# Altium schematic sheet Sheet1.SchDoc: VISB
size 420 x 297 mm; ApprovedBy: PBaizan; CheckedBy: PBaizan; Author: PBaizan; CompanyName: IONOSENS; DrawnBy: PBaizan; Engineer: PBaizan; Organization: IONOSENS; DocumentNumber: 20210001001SCH; Revision: 01; SheetNumber: 01; SheetTotal: 03; PartNumber: 20210001001; SubTitle: VISIR Instrument Supply Board (Control); Scale: None; ConfigElement: VISB; CAGE_CODE: 0001-21; DOC_NO_SCH_DWG: 210001001SCH; PROJECT: VISIR; ENG_APP_DATE: 16/09/2021; DSN_APP_DATE: 16/09/2021; CHK_APP_DATE: 16/09/2021
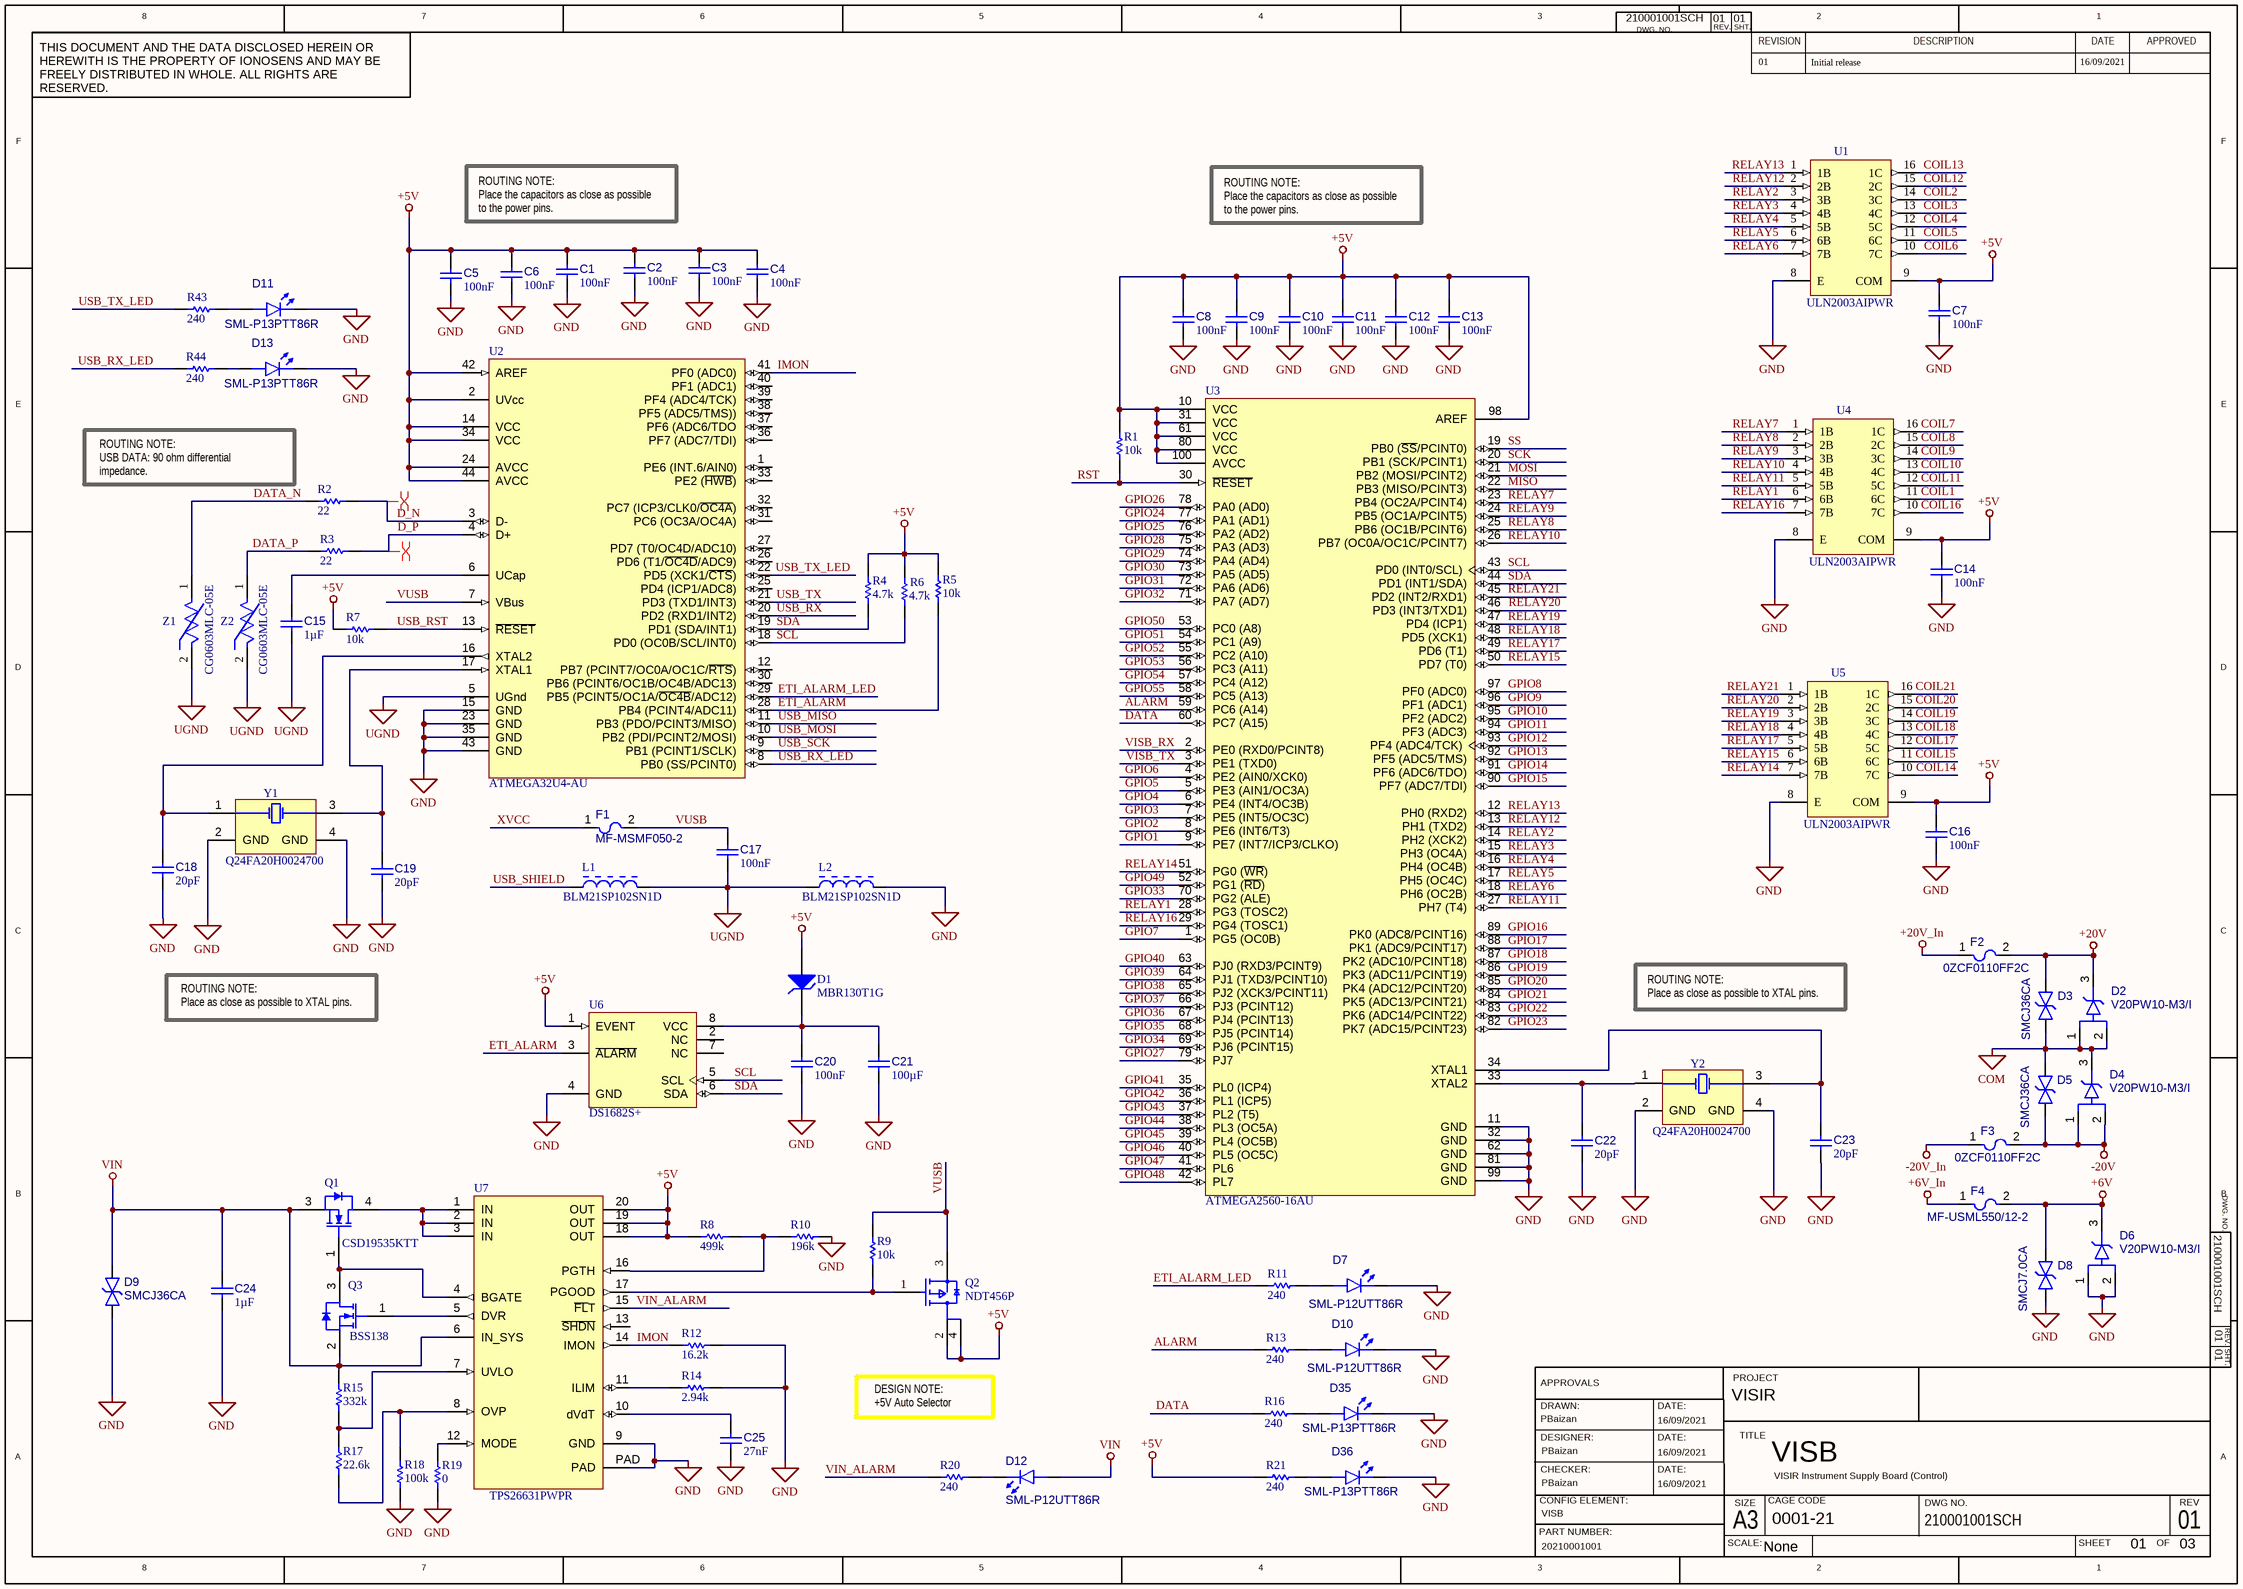
[diagram p0: Sheet1.SchDoc]

## Parts
C1  value 100nF  [CAPC1005X06M]  (hidden comment: CC0402JRX7R7BB104)
C2  value 100nF  [CAPC1005X06M]  (hidden comment: CC0402JRX7R7BB104)
C3  value 100nF  [CAPC1005X06M]  (hidden comment: CC0402JRX7R7BB104)
C4  value 100nF  [CAPC1005X06M]  (hidden comment: CC0402JRX7R7BB104)
C5  value 100nF  [CAPC1005X06M]  (hidden comment: CC0402JRX7R7BB104)
C6  value 100nF  [CAPC1005X06M]  (hidden comment: CC0402JRX7R7BB104)
C7  value 100nF  [CAPC1005X06M]  (hidden comment: CC0402JRX7R7BB104)
C8  value 100nF  [CAPC1005X06M]  (hidden comment: CC0402JRX7R7BB104)
C9  value 100nF  [CAPC1005X06M]  (hidden comment: CC0402JRX7R7BB104)
C10  value 100nF  [CAPC1005X06M]  (hidden comment: CC0402JRX7R7BB104)
C11  value 100nF  [CAPC1005X06M]  (hidden comment: CC0402JRX7R7BB104)
C12  value 100nF  [CAPC1005X06M]  (hidden comment: CC0402JRX7R7BB104)
C13  value 100nF  [CAPC1005X06M]  (hidden comment: CC0402JRX7R7BB104)
C14  value 100nF  [CAPC1005X06M]  (hidden comment: CC0402JRX7R7BB104)
C15  value 1µF  [CAPC1608X09M]  (hidden comment: CC0603JRX7R7BB105)
C16  value 100nF  [CAPC1005X06M]  (hidden comment: CC0402JRX7R7BB104)
C17  value 100nF  [CAPC1005X06M]  (hidden comment: CC0402JRX7R7BB104)
C18  value 20pF  [CAPC1005X06M]  (hidden comment: CC0402JRNPO9BN200)
C19  value 20pF  [CAPC1005X06M]  (hidden comment: CC0402JRNPO9BN200)
C20  value 100nF  [CAPC1005X06M]  (hidden comment: CC0402JRX7R7BB104)
C21  value 100µF  [CAPC3225X27M]  (hidden comment: EMK325ABJ107MM-P)
C22  value 20pF  [CAPC1005X06M]  (hidden comment: CC0402JRNPO9BN200)
C23  value 20pF  [CAPC1005X06M]  (hidden comment: CC0402JRNPO9BN200)
C24  value 1µF  [CAPC3225X22M]  (hidden comment: CC1210KKX7R0BB105)
C25  value 27nF  [CAPC2012X14M]  (hidden comment: CC0805JRX7R9BB273)
D1  MBR130T1G  [TSSOP0P360X135-2M]
D2  V20PW10-M3/I  [DPAK229P900X140-3M]
D3  SMCJ36CA  [DIOM6959X26M]
D4  V20PW10-M3/I  [DPAK229P900X140-3M]
D5  SMCJ36CA  [DIOM6959X26M]
D6  V20PW10-M3/I  [DPAK229P900X140-3M]
D7  SML-P12UTT86R  [DIOC1005X02R]
D8  SMCJ7.0CA  [DIOM6959X26M]
D9  SMCJ36CA  [DIOM6959X26M]
D10  SML-P12UTT86R  [DIOC1005X02R]
D11  SML-P13PTT86R  [DIOC1005X02R]
D12  SML-P12UTT86R  [DIOC1005X02R]
D13  SML-P13PTT86R  [DIOC1005X02R]
D35  SML-P13PTT86R  [DIOC1005X02R]
D36  SML-P13PTT86R  [DIOC1005X02R]
F1  MF-MSMF050-2  [BOUR-MF-MSMF050-2_V]
F2  0ZCF0110FF2C  [RESC7451X09M]
F3  0ZCF0110FF2C  [RESC7451X09M]
F4  MF-USML550/12-2  [RESC3226X12M]
L1  BLM21SP102SN1D  [INDC2012X10M]
L2  BLM21SP102SN1D  [INDC2012X10M]
Q1  CSD19535KTT  [DPAK254P1510X470-3M]
Q2  NDT456P  [SOT230P700X180-4M]
Q3  BSS138  [SOT95P237X111-3M]
R1  value 10k  [RESC1005X04M]  (hidden comment: AC0402FR-0710KL)
R2  value 22  [RESC1005X04M]  (hidden comment: AC0402FR-0722RL)
R3  value 22  [RESC1005X04M]  (hidden comment: AC0402FR-0722RL)
R4  value 4.7k  [RESC1005X04M]  (hidden comment: AC0402FR-074K7L)
R5  value 10k  [RESC1005X04M]  (hidden comment: AC0402FR-0710KL)
R6  value 4.7k  [RESC1005X04M]  (hidden comment: AC0402FR-074K7L)
R7  value 10k  [RESC1005X04M]  (hidden comment: AC0402FR-0710KL)
R8  value 499k  [RESC1005X04M]  (hidden comment: AC0402FR-07499KL)
R9  value 10k  [RESC1005X04M]  (hidden comment: AC0402FR-0710KL)
R10  value 196k  [RESC1005X04M]  (hidden comment: AC0402FR-07196KL)
R11  value 240  [RESC1005X04M]  (hidden comment: AC0402FR-07240RL)
R12  value 16.2k  [RESC1005X04M]  (hidden comment: AC0402FR-0716K2L)
R13  value 240  [RESC1005X04M]  (hidden comment: AC0402FR-07240RL)
R14  value 2.94k  [RESC1005X04M]  (hidden comment: AC0402FR-072K94L)
R15  value 332k  [RESC1005X04M]  (hidden comment: AC0402FR-07332KL)
R16  value 240  [RESC1005X04M]  (hidden comment: AC0402FR-07240RL)
R17  value 22.6k  [RESC1005X04M]  (hidden comment: AC0402FR-0722K6L)
R18  value 100k  [RESC1005X04M]  (hidden comment: AC0402FR-07100KL)
R19  value 0  [RESC1608X06M]  (hidden comment: AC0603FR-070RL)
R20  value 240  [RESC1005X04M]  (hidden comment: AC0402FR-07240RL)
R21  value 240  [RESC1005X04M]  (hidden comment: AC0402FR-07240RL)
R43  value 240  [RESC1005X04M]  (hidden comment: AC0402FR-07240RL)
R44  value 240  [RESC1005X04M]  (hidden comment: AC0402FR-07240RL)
U1  ULN2003AIPWR  [TSOP65P640X120-16M]
U2  ATMEGA32U4-AU  [TQFP80P1200X1200X120-44M]
U3  ATMEGA2560-16AU  [ATML-100A_M]
U4  ULN2003AIPWR  [TSOP65P640X120-16M]
U5  ULN2003AIPWR  [TSOP65P640X120-16M]
U6  DS1682S+  [SOIC127P600X175-8M]
U7  TPS26631PWPR  [TSOP65P640X120_HS-21M]
Y1  Q24FA20H0024700  [FA-20H]
Y2  Q24FA20H0024700  [FA-20H]
Z1  CG0603MLC-05E  [RESC1608X06M]
Z2  CG0603MLC-05E  [RESC1608X06M]

## Nets
+5V: C1.2 C2.2 C3.2 C4.2 C5.2 C6.2 C7.2 C8.2 C9.2 C10.2 C11.2 C12.2 C13.2 C14.2 C16.2 D1.1(A) Q2.2(D) Q2.4(D) R1.2 R4.2 R5.2 R6.2 R7.2 R8.2 R21.1 U1.9(COM) U2.2(UVcc) U2.14(VCC) U2.24(AVCC) U2.34(VCC) U2.42(AREF) U2.44(AVCC) U3.10(VCC) U3.31(VCC) U3.61(VCC) U3.80(VCC) U3.98(AREF) U3.100(AVCC) U4.9(COM) U5.9(COM) U6.1(EVENT) U7.18(OUT) U7.19(OUT) U7.20(OUT)
+6V: D6.3(K) D8.2(A) F4.2
+6V_In: F4.1
+20V: D2.3(K) D3.1(A) F2.2
+20V_In: F2.1
-20V: D4.1(A) D4.2(A) D5.2(A) F3.2
-20V_In: F3.1
COM: D2.1(A) D2.2(A) D3.2(A) D4.3(K) D5.1(A)
GND: C1.1 C2.1 C3.1 C4.1 C5.1 C6.1 C7.1 C8.1 C9.1 C10.1 C11.1 C12.1 C13.1 C14.1 C16.1 C18.1 C19.1 C20.1 C21.1 C22.1 C23.1 C24.1 C25.1 D6.1(A) D6.2(A) D7.1(K) D8.1(A) D9.2(A) D10.1(K) D11.1(K) D13.1(K) D35.1(K) D36.1(K) L2.2 R10.1 R12.2 R14.2 R18.1 R19.1 U1.8(E) U2.15(GND) U2.23(GND) U2.35(GND) U2.43(GND) U3.11(GND) U3.32(GND) U3.62(GND) U3.81(GND) U3.99(GND) U4.8(E) U5.8(E) U6.4(GND) U7.9(GND) U7.PAD Y1.2(GND) Y1.4(GND) Y2.2(GND) Y2.4(GND)
UGND: C15.1 C17.1 L1.2 L2.1 U2.5(UGnd) Z1.2 Z2.2
VIN: C24.2 D9.1(A) D12.2(A) Q1.3(S) Q3.2(S) R15.2 U7.6(IN_SYS)
ALARM: R13.1 U3.59(PC6_(A14))
COIL1: U4.11(6C)
COIL2: U1.14(3C)
COIL3: U1.13(4C)
COIL4: U1.12(5C)
COIL5: U1.11(6C)
COIL6: U1.10(7C)
COIL7: U4.16(1C)
COIL8: U4.15(2C)
COIL9: U4.14(3C)
COIL10: U4.13(4C)
COIL11: U4.12(5C)
COIL12: U1.15(2C)
COIL13: U1.16(1C)
COIL14: U5.10(7C)
COIL15: U5.11(6C)
COIL16: U4.10(7C)
COIL17: U5.12(5C)
COIL18: U5.13(4C)
COIL19: U5.14(3C)
COIL20: U5.15(2C)
COIL21: U5.16(1C)
D_N: R2.2 U2.3(D-)
D_P: R3.2 U2.4(D+)
DATA: R16.1 U3.60(PC7_(A15))
DATA_N: R2.1 Z1.1
DATA_P: R3.1 Z2.1
ETI_ALARM: R5.1 U2.28(PB4_(PCINT4/ADC11)) U6.3(~{ALARM})
ETI_ALARM_LED: R11.1 U2.29(PB5_(PCINT5/OC1A/~{OC4B}/ADC12))
GPIO1: U3.9(PE7_(INT7/ICP3/CLKO))
GPIO2: U3.8(PE6_(INT6/T3))
GPIO3: U3.7(PE5_(INT5/OC3C))
GPIO4: U3.6(PE4_(INT4/OC3B))
GPIO5: U3.5(PE3_(AIN1/OC3A))
GPIO6: U3.4(PE2_(AIN0/XCK0))
GPIO7: U3.1(PG5_(OC0B))
GPIO8: U3.97(PF0_(ADC0))
GPIO9: U3.96(PF1_(ADC1))
GPIO10: U3.95(PF2_(ADC2))
GPIO11: U3.94(PF3_(ADC3))
GPIO12: U3.93(PF4_(ADC4/TCK))
GPIO13: U3.92(PF5_(ADC5/TMS))
GPIO14: U3.91(PF6_(ADC6/TDO))
GPIO15: U3.90(PF7_(ADC7/TDI))
GPIO16: U3.89(PK0_(ADC8/PCINT16))
GPIO17: U3.88(PK1_(ADC9/PCINT17))
GPIO18: U3.87(PK2_(ADC10/PCINT18))
GPIO19: U3.86(PK3_(ADC11/PCINT19))
GPIO20: U3.85(PK4_(ADC12/PCINT20))
GPIO21: U3.84(PK5_(ADC13/PCINT21))
GPIO22: U3.83(PK6_(ADC14/PCINT22))
GPIO23: U3.82(PK7_(ADC15/PCINT23))
GPIO24: U3.77(PA1_(AD1))
GPIO25: U3.76(PA2_(AD2))
GPIO26: U3.78(PA0_(AD0))
GPIO27: U3.79(PJ7)
GPIO28: U3.75(PA3_(AD3))
GPIO29: U3.74(PA4_(AD4))
GPIO30: U3.73(PA5_(AD5))
GPIO31: U3.72(PA6_(AD6))
GPIO32: U3.71(PA7_(AD7))
GPIO33: U3.70(PG2_(ALE))
GPIO34: U3.69(PJ6_(PCINT15))
GPIO35: U3.68(PJ5_(PCINT14))
GPIO36: U3.67(PJ4_(PCINT13))
GPIO37: U3.66(PJ3_(PCINT12))
GPIO38: U3.65(PJ2_(XCK3/PCINT11))
GPIO39: U3.64(PJ1_(TXD3/PCINT10))
GPIO40: U3.63(PJ0_(RXD3/PCINT9))
GPIO41: U3.35(PL0_(ICP4))
GPIO42: U3.36(PL1_(ICP5))
GPIO43: U3.37(PL2_(T5))
GPIO44: U3.38(PL3_(OC5A))
GPIO45: U3.39(PL4_(OC5B))
GPIO46: U3.40(PL5_(OC5C))
GPIO47: U3.41(PL6)
GPIO48: U3.42(PL7)
GPIO49: U3.52(PG1_(~{RD}))
GPIO50: U3.53(PC0_(A8))
GPIO51: U3.54(PC1_(A9))
GPIO52: U3.55(PC2_(A10))
GPIO53: U3.56(PC3_(A11))
GPIO54: U3.57(PC4_(A12))
GPIO55: U3.58(PC5_(A13))
IMON: R12.1 U2.41(PF0_(ADC0)) U7.14(IMON)
MISO: U3.22(PB3_(MISO/PCINT3))
MOSI: U3.21(PB2_(MOSI/PCINT2))
RELAY1: U3.28(PG3_(TOSC2)) U4.6(6B)
RELAY2: U1.3(3B) U3.14(PH2_(XCK2))
RELAY3: U1.4(4B) U3.15(PH3_(OC4A))
RELAY4: U1.5(5B) U3.16(PH4_(OC4B))
RELAY5: U1.6(6B) U3.17(PH5_(OC4C))
RELAY6: U1.7(7B) U3.18(PH6_(OC2B))
RELAY7: U3.23(PB4_(OC2A/PCINT4)) U4.1(1B)
RELAY8: U3.25(PB6_(OC1B/PCINT6)) U4.2(2B)
RELAY9: U3.24(PB5_(OC1A/PCINT5)) U4.3(3B)
RELAY10: U3.26(PB7_(OC0A/OC1C/PCINT7)) U4.4(4B)
RELAY11: U3.27(PH7_(T4)) U4.5(5B)
RELAY12: U1.2(2B) U3.13(PH1_(TXD2))
RELAY13: U1.1(1B) U3.12(PH0_(RXD2))
RELAY14: U3.51(PG0_(~{WR})) U5.7(7B)
RELAY15: U3.50(PD7_(T0)) U5.6(6B)
RELAY16: U3.29(PG4_(TOSC1)) U4.7(7B)
RELAY17: U3.49(PD6_(T1)) U5.5(5B)
RELAY18: U3.48(PD5_(XCK1)) U5.4(4B)
RELAY19: U3.47(PD4_(ICP1)) U5.3(3B)
RELAY20: U3.46(PD3_(INT3/TXD1)) U5.2(2B)
RELAY21: U3.45(PD2_(INT2/RXD1)) U5.1(1B)
RST: R1.1 U3.30(~{RESET})
SCK: U3.20(PB1_(SCK/PCINT1))
SCL: R6.1 U2.18(PD0_(OC0B/SCL/INT0)) U3.43(PD0_(INT0/SCL)) U6.5(SCL)
SDA: R4.1 U2.19(PD1_(SDA/INT1)) U3.44(PD1_(INT1/SDA)) U6.6(SDA)
SS: U3.19(PB0_(~{SS}/PCINT0))
USB_MISO: U2.11(PB3_(PDO/PCINT3/MISO))
USB_MOSI: U2.10(PB2_(PDI/PCINT2/MOSI))
USB_RST: R7.1 U2.13(~{RESET})
USB_RX: U2.20(PD2_(RXD1/INT2))
USB_RX_LED: R44.1 U2.8(PB0_(SS/PCINT0))
USB_SCK: U2.9(PB1_(PCINT1/SCLK))
USB_SHIELD: L1.1
USB_TX: U2.21(PD3_(TXD1/INT3))
USB_TX_LED: R43.1 U2.22(PD5_(XCK1/~{CTS}))
VIN_ALARM: R20.1 U7.15(~{FL}T)
VISB_RX: U3.2(PE0_(RXD0/PCINT8))
VISB_TX: U3.3(PE1_(TXD0))
VUSB: C17.2 F1.2 Q2.3(S) R9.2 U2.7(VBus)
XVCC: F1.1
NetC15_2: C15.2 U2.6(UCap)
NetC18_2: C18.2 U2.16(XTAL2) Y1.1(X1)
NetC19_2: C19.2 U2.17(XTAL1) Y1.3(X2)
NetC20_2: C20.2 C21.2 D1.2(K) U6.8(VCC)
NetC22_2: C22.2 U3.33(XTAL2) Y2.1(X1)
NetC23_2: C23.2 U3.34(XTAL1) Y2.3(X2)
NetC25_2: C25.2 U7.10(dVdT)
NetD7_2: D7.2(A) R11.2
NetD10_2: D10.2(A) R13.2
NetD11_2: D11.2(A) R43.2
NetD12_1: D12.1(K) R20.2
NetD13_2: D13.2(A) R44.2
NetD35_2: D35.2(A) R16.2
NetD36_2: D36.2(A) R21.2
NetQ1_1: Q1.1(G) Q3.3(D) U7.4(BGATE)
NetQ1_4: Q1.4(D) U7.1(IN) U7.2(IN) U7.3(IN)
NetQ2_1: Q2.1(G) R9.1 U7.17(PGOOD)
NetQ3_1: Q3.1(G) U7.5(DVR)
NetR8_1: R8.1 R10.2 U7.16(PGTH)
NetR14_1: R14.1 U7.11(ILIM)
NetR15_1: R15.1 R17.2 U7.7(UVLO)
NetR17_1: R17.1 R18.2 U7.8(OVP)
NetR19_2: R19.2 U7.12(MODE)

Not connected (* = marked no-connect by the designer): U2 1(PE6_(INT.6/AIN0)) 12(PB7_(PCINT7/OC0A/OC1C/~{RTS})) 25(PD4_(ICP1/ADC8)) 26(PD6_(T1/~{OC4D}/ADC9)) 27(PD7_(T0/OC4D/ADC10)) 30(PB6_(PCINT6/OC1B/OC4B/ADC13)) 31(PC6_(OC3A/OC4A)) 32(PC7_(ICP3/CLK0/~{OC4A})) 33(PE2_(~{HWB})) 36(PF7_(ADC7/TDI)) 37(PF6_(ADC6/TDO) 38(PF5_(ADC5/TMS))) 39(PF4_(ADC4/TCK)) 40(PF1_(ADC1)); U6 2(NC) 7(NC); U7 13(~{SHDN})

## Layout directives
differential pair: D_N, D_P

## Notes on the sheet
- 01
- Initial release
- 16/09/2021
- ROUTING NOTE:
  Place the capacitors as close as possible to the power pins.
- ROUTING NOTE:
  USB DATA: 90 ohm differential impedance.
- ROUTING NOTE:
  Place as close as possible to XTAL pins.
- DESIGN NOTE:
  +5V Auto Selector
- 8
- 7
- 6
- 5
- 4
- 3
- DWG. NO.
- REV.
- SHT.
- REVISION
- 2
- DESCRIPTION
- DATE
- 1
- APPROVED
- THIS DOCUMENT AND THE DATA DISCLOSED HEREIN OR HEREWITH IS THE PROPERTY OF IONOSENS AND MAY BE FREELY DISTRIBUTED IN WHOLE. ALL RIGHTS ARE RESERVED.
- F
- E
- D
- C
- B
- DRAWN:
- APPROVALS
- DATE:
- PROJECT
- A
- CHECKER:
- DESIGNER:
- TITLE
- PART NUMBER:
- CONFIG ELEMENT:
- SCALE:
- A3
- SIZE
- CAGE CODE
- DWG NO.
- SHEET
- OF
- REV

## Library data of the parts
C1-C14 C16 C17 C20 = C01-0402-01-00001-1: Cap Ceramic 100nF 50V X7R 5% SMD 0402 125°C; Manufacturer: YAGEO; Voltage Rating: 16V; Case/Package: 0402; Capacitor Type: Ceramic; Min Operating Temperature: -55°C; Width: 508µm; Length: 1mm; Tolerance: 5%; Dielectric: X7R; RoHS Compliant: Yes; Pins: 2; Composition: Ceramic; Depth: 500µm; Voltage Rating (DC): 16V; Mount: Surface Mount; Mounting Technology: Surface Mount; Termination: SMD/SMT; Manufacturer P/N: CC0402JRX7R7BB104; Thickness: 558.8µm; Max Operating Temperature: 125°C
C15 = C01-0402-01-00004-1: Cap Ceramic 1uF 16V XR7 5% SMD 0603 125°C; Manufacturer: YAGEO; Voltage Rating: 16V; Pins: 2; Width: 810µm; Manufacturer P/N: CC0603JRX7R7BB105; Depth: 800µm; Capacitor Type: Ceramic; Max Operating Temperature: 125°C; Mounting Technology: Surface Mount; Dielectric: XR7; Mount: Surface Mount; Voltage Rating (DC): 16V; Composition: Ceramic; Tolerance: 5%; RoHS Compliant: Yes; Min Operating Temperature: -55°C; Thickness: 800µm; Termination: SMD/SMT; Length: 1.6mm; Case/Package: 0603
C18 C19 C22 C23 = C01-0402-01-00008-1: Cap Ceramic 20pF 50V C0G 5% SMD 0402 125°C; Manufacturer: YAGEO; Dielectric: COG; Case/Package: 0402; Tolerance: 5%; Thickness: 558.8µm; Termination: SMD/SMT; Manufacturer P/N: CC0402JRNPO9BN200; Voltage Rating: 50V; Length: 990.6µm; Depth: 500µm; Width: 508µm; Min Operating Temperature: -55°C; Mount: Surface Mount; Voltage Rating (DC): 50V; Pins: 2; Capacitor Type: Ceramic; RoHS Compliant: Yes; Composition: Ceramic; Mounting Technology: Surface Mount; Max Operating Temperature: 125°C
C21 = C01-0402-01-00002-1: Multilayer Ceramic Capacitors (High dielectric type), 16V, 100 uF, ± 20 %, 1210, X5R, RoHS; Manufacturer: Taiyo Yuden; Tolerance: 20%; Dielectric: XR5; Min Operating Temperature: -55°C; Voltage Rating (DC): 16V; Pins: 2; Composition: Ceramic; Mount: SMD; Manufacturer P/N: EMK325ABJ107MM-P; Capacitor Type: Multilayer Ceramic; Thickness: 2.2m; RoHS Compliant: Yes; Termination: -; Depth: 2.2m; Case/Package: 1210; Max Operating Temperature: 85°C; Voltage Rating: 16V; Length: 3.5m; Width: 2.8m; Mounting Technology: SMD
C24 = C01-0402-01-00005-1: 1210 100 V 1 uF X7R ±10% Tolerance Multilayer Ceramic Chip Capacitor; Manufacturer: YAGEO; Voltage Rating (DC): 100V; Depth: 2.5mm; Case/Package: 1210; Width: 2.4892mm; Manufacturer P/N: CC1210KKX7R0BB105; Tolerance: 10%; Min Operating Temperature: -55°C; RoHS Compliant: Yes; Capacitor Type: Multilayer Ceramic; Composition: Ceramic; Thickness: 2.2098mm; Mount: Surface Mount; Termination: -; Length: 3.2004mm; Max Operating Temperature: 125°C; Mounting Technology: SMD; Voltage Rating: 100V; Dielectric: X7R; Pins: 2
C25 = C01-0402-01-00003-1: Cap Ceramic 27nF 50V X7R 5% SMD 0805 125°C; Manufacturer: YAGEO; Dielectric: XR7; Manufacturer P/N: CC0805JRX7R9BB273; Termination: SMD/SMT; Depth: 1.25mm; Max Operating Temperature: 125°C; Voltage Rating (DC): 50V; Length: 2mm; Capacitor Type: Ceramic; RoHS Compliant: Yes; Case/Package: 0805; Thickness: 711.2µm; Mount: Surface Mount; Width: 1.2466mm; Voltage Rating: 50V; Tolerance: 5%; Mounting Technology: Surface Mount; Min Operating Temperature: -55°C; Pins: 2; Composition: Ceramic
D1 = CMP-004-00031-2: DIODE SCHOTTKY 30V 1A SOD123 / Rectifier Diode Schottky 30V 1A 2-Pin SOD-123; Manufacturer: ON Semiconductor; Forward Voltage: 470mV; Max Surge Current: 5.5A; Forward Current: 1A; Mounting Technology: SMD; Manufacturer P/N: MBR130T1G; RoHS Compliant: yes; Pins: 2; Case/Package: SOD-123-2; Max Operating Temperature: 125°C; Min Operating Temperature: -65°C; Peak Inverse Voltage: 30V
D2 D4 D6 = CMP-004-00033-1: Schottky Rectifier, 100V, 20A, TO-252AE Rohs Compliant: Yes; Manufacturer: Vishay; Forward Voltage: 600mV; Max Surge Current: 200A; Case/Package: SlimDPAK (TO-252AE); Max Operating Temperature: 150°C; Manufacturer P/N: V20PW10-M3/I; Forward Current: 20A; Pins: 3; Peak Inverse Voltage: 100V; RoHS Compliant: Yes; Min Operating Temperature: -40°C; Mounting Technology: SMD
D3 D5 D9 = CMP-004-00032-1: Diode Tvs Vwm 36V 1.5Kw Bidir Smc Rohs Compliant; Manufacturer: Bourns; Peak Inverse Voltage: 40V; Max Surge Current: 200A; Manufacturer P/N: SMCJ36CA; Max Operating Temperature: 150°C; Pins: 2; Min Operating Temperature: -55°C; RoHS Compliant: Yes; Mounting Technology: SMD; Case/Package: SMD; Forward Voltage: 40V; Forward Current: 200A
D7 D10 D12 = D01-0402-01-00001-1: Led red 0402; Manufacturer: ROHM; Number of LEDs: 1; Max Power Dissipation: 52mW; Luminous Intensity: 85 mcd; Dominant Wavelength: 620 nm; Lens Style: Rectangular, Square; Forward Current: 20 mA; Forward Voltage: 2V; Mounting Technology: SMD; Case/Package: 0402; Min Operating Temperature: -40°C; Max Operating Temperature: 85°C; Manufacturer P/N: SML-P12UTT86R; Colour: red; RoHS Compliant: Yes; Pins: 2
D8 = CMP-004-00035-1: Diode Tvs Vwm 7V 1.5Kw Bidir Smc Rohs Compliant; Manufacturer: Bourns; Peak Inverse Voltage: 7.78V; Max Surge Current: 125A; Manufacturer P/N: SMCJ7.0CA; Min Operating Temperature: -55°C; Forward Voltage: 7.78V; Mounting Technology: SMD; Forward Current: 125A; Case/Package: SMD; Pins: 2; Max Operating Temperature: 150°C; RoHS Compliant: Yes
D11 D13 D35 D36 = D01-0402-01-00000-1: Led green 0402; Manufacturer: ROHM; Forward Voltage: 2.1V; Max Power Dissipation: 52mW; Forward Current: 20 mA; Number of LEDs: 1; Dominant Wavelength: 560 nm; Luminous Intensity: 10 mcd; Lens Style: Rectangular, Square; Min Operating Temperature: -40°C; Mounting Technology: SMD; Colour: Green; Manufacturer P/N: SML-P13PTT86R; Max Operating Temperature: 85°C; Pins: 2; RoHS Compliant: Yes; Case/Package: 0402
F1 = CMP-005-00013-1: PTC Resettable Fuse 0.5A(hold) 1A(trip) 15V 100A 0.8W 0.15s 0.15Ohm SMD Solder Pad 1812; Manufacturer: Bourns; Pins: 2; Voltage: 15V; Current Rating: 1A; RoHS Compliant: Yes; Min Operating Temperature: -40°C; Manufacturer P/N: MF-MSMF050-2; Case/Package: 1812; Max Operating Temperature: 85°C; Mounting Technology: SMD
F2 F3 = CMP-005-00014-1: PTC Resettable Fuse 1.1A(hold) 2.2A(trip) 33VDC 100A 1.5W 0.5s 0.09Ohm SMD Solder Pad 2920 T/R Automotive; Manufacturer: BelFuse; Voltage: 33V; Manufacturer P/N: 0ZCF0110FF2C; Case/Package: 2920; RoHS Compliant: Yes; Min Operating Temperature: -40°C; Current Rating: 1.1A; Mounting Technology: SMD; Max Operating Temperature: 85°C; Pins: 2
F4 = CMP-005-00015-1: Low Ohmic PTC Resettable Fuse 5.5A 12V 1210 T/R; Manufacturer: Bourns; Max Operating Temperature: 85°C; Manufacturer P/N: MF-USML550/12-2; Current Rating: 5.5A; Pins: 2; Case/Package: 1210; RoHS Compliant: Yes; Mounting Technology: SMD; Min Operating Temperature: -40°C; Voltage: 12V
L1 L2 = R01-0805-01-00691-1: Ferrite Beads Multi-Layer High Current 1KOhm 25% 100MHz 1.6A 0.12Ohm DCR 0805; Manufacturer: Murata Electronics; DC Resistance (DCR): 0.4; Impedance: 1k; Number of Pins: 2; Length: 2mm; Material: Ferrite; Depth: 1.25mm; Manufacturer P/N: BLM21SP102SN1D; Min Operating Temperature: 125°C; Core Material: Ferrite; Current Rating: 1.6A; Width: 1.25mm; Contact Plating: Tin; Case/Package: 0805; Frequency: 100MHz; RoHS: Yes; Height: 1.05mm; Max Operating Temperature: -55°C
Q1 = CMP-013-00034-1: 100-V, N channel NexFET™ power MOSFET, single D2PAK, 3.4 mOhm 3-DDPAK/TO-263 -55 to 175; Manufacturer: Texas Instrument; Vgs (Max): 20V; Power: 300W; Max Operating Temperature: 175°C; Case/Package: DDPAK; Manufacturer P/N: CSD19535KTT; RoHS Compliant: Yes; Pins: 3; Mounting Technology: SMD; Min Operating Temperature: -55°C; Transistor Type: MOSFET; Vgs(th) (Max) @ Id: 20V
Q2 = CMP-013-00035-1: Transistor MOSFET P-Channel 30V 7.5A 3W (Ta) Surface Mount SOT-223-4; Manufacturer: ON Semiconductor; Vgs (Max): 20V; Vgs(th) (Max) @ Id: 1.5V; Min Operating Temperature: -65°C; RoHS Compliant: Yes; Mounting Technology: SMD; Max Operating Temperature: 150°C; Case/Package: SOT-223; Transistor Type: MOSFET P-Channel; Pins: 4; Power: 3W; Manufacturer P/N: NDT456P
Q3 = CMP-013-00021-4: N-Channel Logic Level Enhancement Mode Field Effect Transistor, 220 mA, 50 V, -55 to 150 degC, 3-Pin SOT-23, RoHS, Tape and Reel; Manufacturer: Fairchild; Nominal Vgs: 1.3V; Resistance: 0.7Ohm; Input Capacitance: 27pF; Elements: 1; Rds On Max: 3.5Ohm; Typical Rise Time: 9ns; Power: 360mW; Nominal Dual Supply Voltage: 50V; Package Version: Rev. 12, 03/2016; Packaging: TapeandReel; Min Operating Temperature: -55°C; Mounting Technology: SM; Package Description: 3-Pin Small Outline Transistor, Body 2.92 x 1.325 mm, Pitch 0.95 mm; Pins: 3; Max Operating Temperature: 150°C; Package Reference: SOT23-3; RoHS Compliant: True; Case/Package: TO-236-3; Package Quantity: 1; Manufacturer P/N: BSS138
R1 R5 R7 R9 = R01-0402-01-00169-2: RES SMD 10K OHM 1% 1/16W 0402; Manufacturer: Yageo; Temperature Coefficient: 100 ppm/ºC; Power Rating: 62.5mW; Voltage Rating: 50V; Length: 990.6µm; Height: 370µm; Min Operating Temperature: -55°C; Case/Package: 0402; Features: Automotive AEC-Q200, Moisture Resistant; Packaging: Tape & Reel; Width: 508µm; Manufacturer P/N: AC0402FR-0710KL; RoHS: Yes; Max Operating Temperature: 155°C; Tolerance: 1%; Composition: Thick Film; Number of Terminations: 2
R2 R3 = R01-0402-01-00227-3: RES SMD 22 OHM 1% 1/16W 0402; Manufacturer: Yageo; Temperature Coefficient: 100 ppm/ºC; Power Rating: 62.5mW; Voltage Rating: 50V; Number of Terminations: 2; Min Operating Temperature: -55°C; Max Operating Temperature: 155°C; Packaging: Tape & Reel; Length: 990.6µm; Case/Package: 0402; Composition: Thick Film; RoHS: Yes; Tolerance: 1%; Width: 508µm; Height: 370µm; Manufacturer P/N: AC0402FR-0722RL; Features: Automotive AEC-Q200, Moisture Resistant
R4 R6 = R01-0402-01-00105-2: RES SMD 4.7K OHM 1% 1/16W 0402; Manufacturer: Yageo; Temperature Coefficient: 100 ppm/ºC; Power Rating: 62.5mW; Voltage Rating: 50V; Width: 508µm; Max Operating Temperature: 155°C; Manufacturer P/N: AC0402FR-074K7L; Features: Automotive AEC-Q200, Moisture Resistant; Number of Terminations: 2; Height: 370µm; Min Operating Temperature: -55°C; Case/Package: 0402; Tolerance: 1%; RoHS: Yes; Packaging: Tape & Reel; Composition: Thick Film; Length: 990.6µm
R8 = R01-0402-01-00510-2: RES SMD 499K OHM 1% 1/16W 0402; Manufacturer: Yageo; Power Rating: 62.5mW; Temperature Coefficient: 100 ppm/ºC; Voltage Rating: 50V; Height: 370µm; Number of Terminations: 2; RoHS: Yes; Features: Automotive AEC-Q200, Moisture Resistant; Length: 990.6µm; Case/Package: 0402; Width: 508µm; Manufacturer P/N: AC0402FR-07499KL; Composition: Thick Film; Max Operating Temperature: 155°C; Min Operating Temperature: -55°C; Packaging: Tape & Reel; Tolerance: 1%
R10 = R01-0402-01-00418-2: RES SMD 196K OHM 1% 1/16W 0402; Manufacturer: Yageo; Temperature Coefficient: 100 ppm/ºC; Power Rating: 62.5mW; Voltage Rating: 50V; Composition: Thick Film; RoHS: Yes; Features: Automotive AEC-Q200, Moisture Resistant; Width: 508µm; Tolerance: 1%; Length: 990.6µm; Height: 370µm; Max Operating Temperature: 155°C; Number of Terminations: 2; Packaging: Tape & Reel; Min Operating Temperature: -55°C; Manufacturer P/N: AC0402FR-07196KL; Case/Package: 0402
R11 R13 R16 R20 R21 R43 R44 = R01-0402-01-00437-2: RES SMD 240 OHM 1% 1/16W 0402; Manufacturer: Yageo; Temperature Coefficient: 100 ppm/ºC; Power Rating: 62.5mW; Voltage Rating: 50V; Packaging: Tape & Reel; Manufacturer P/N: AC0402FR-07240RL; Height: 370µm; Case/Package: 0402; Composition: Thick Film; Max Operating Temperature: 155°C; Number of Terminations: 2; RoHS: Yes; Min Operating Temperature: -55°C; Tolerance: 1%; Width: 508µm; Length: 990.6µm; Features: Automotive AEC-Q200, Moisture Resistant
R12 = R01-0402-01-00196-4: RES SMD 16.2K OHM 1% 1/16W 0402; Manufacturer: Yageo; Temperature Coefficient: 100 ppm/ºC; Voltage Rating: 50V; Power Rating: 62.5mW; Packaging: Tape & Reel; Case/Package: 0402; Min Operating Temperature: -55°C; Max Operating Temperature: 155°C; Height: 370µm; Number of Terminations: 2; Length: 990.6µm; Composition: Thick Film; Tolerance: 1%; RoHS: Yes; Manufacturer P/N: AC0402FR-0716K2L; Features: Automotive AEC-Q200, Moisture Resistant; Width: 508µm
R14 = R01-0402-01-00066-2: RES SMD 2.94K OHM 1% 1/16W 0402; Manufacturer: Yageo; Voltage Rating: 50V; Power Rating: 62.5mW; Temperature Coefficient: 100 ppm/ºC; Max Operating Temperature: 155°C; Manufacturer P/N: AC0402FR-072K94L; RoHS: Yes; Features: Automotive AEC-Q200, Moisture Resistant; Height: 370µm; Width: 508µm; Length: 990.6µm; Tolerance: 1%; Composition: Thick Film; Packaging: Tape & Reel; Case/Package: 0402; Number of Terminations: 2; Min Operating Temperature: -55°C
R15 = R01-0402-01-00471-2: RES SMD 332K OHM 1% 1/16W 0402; Manufacturer: Yageo; Voltage Rating: 50V; Power Rating: 62.5mW; Temperature Coefficient: 100 ppm/ºC; Width: 508µm; RoHS: Yes; Height: 370µm; Length: 990.6µm; Max Operating Temperature: 155°C; Manufacturer P/N: AC0402FR-07332KL; Tolerance: 1%; Features: Automotive AEC-Q200, Moisture Resistant; Number of Terminations: 2; Min Operating Temperature: -55°C; Composition: Thick Film; Case/Package: 0402; Packaging: Tape & Reel
R17 = R01-0402-01-00223-2: RES SMD 22.6K OHM 1% 1/16W 0402; Manufacturer: Yageo; Power Rating: 62.5mW; Voltage Rating: 50V; Temperature Coefficient: 100 ppm/ºC; Length: 990.6µm; Features: Automotive AEC-Q200, Moisture Resistant; Min Operating Temperature: -55°C; Case/Package: 0402; Composition: Thick Film; Number of Terminations: 2; Packaging: Tape & Reel; Manufacturer P/N: AC0402FR-0722K6L; Height: 370µm; Max Operating Temperature: 155°C; RoHS: Yes; Width: 508µm; Tolerance: 1%
R18 = R01-0402-01-00360-2: RES SMD 100K OHM 1% 1/16W 0402; Manufacturer: Yageo; Voltage Rating: 50V; Power Rating: 62.5mW; Temperature Coefficient: 100 ppm/ºC; Manufacturer P/N: AC0402FR-07100KL; Packaging: Tape & Reel; Features: Automotive AEC-Q200, Moisture Resistant; Width: 508µm; RoHS: Yes; Height: 370µm; Number of Terminations: 2; Min Operating Temperature: -55°C; Max Operating Temperature: 155°C; Length: 990.6µm; Composition: Thick Film; Case/Package: 0402; Tolerance: 1%
R19 = R01-0603-01-00000-4: RES SMD 0 OHM 1% 1/10W 0603; Manufacturer: Yageo; Power Rating: 100mW; Temperature Coefficient: 200 ppm/ºC; Voltage Rating1: 75V; Voltage Rating: 50V; Number of Terminations: 2; Length: 1.6002µm; Composition: Thick Film; Min Operating Temperature: -55°C; Max Operating Temperature: 155°C; Width: 800µm; Height: 550µm; Case/Package: 0603; RoHS: Yes; Manufacturer P/N: AC0603FR-070RL; Tolerance: 1%; Features: Automotive AEC-Q200, Moisture Resistant; Packaging: Tape & Reel
U1 U4 U5 = CMP-0005-0001-00001-1: 50-V, 7-ch darlington transistor array, -40 to 105C 16-TSSOP -40 to 105; Manufacturer: Texas Instruments; Voltage Rating: 50V; Min Operating Temperature: 105°C; RoHS Compliant: yes; Pins: 16; Case/Package: TSSOP; Mounting Technology: SMD; Length: 5mm; Manufacturer P/N: ULN2003AIPWR; Height: 1.2mm; Max Operating Temperature: -40°C; Width: 4.4mm
U2 = U01-0007-01-00002-1: 8-bit AVR MCU, 32 KB, 2560 Bytes, 16 MHz, 2.7 to 5.5V, TQFP-44, RoHS; Manufacturer: Microchip/Atmel; Minimum Supply Voltage: 2.7V; Frequency: 16MHz; Peripherals: Brown-out Detect/Reset, POR, PWM, WDT; Memory Type: Flash; Memory Size: 32KB; RAM Size: 2.5 kB; Number of I/O: 26; Oscillator Type: External; Interface: I2C, I2S, SPI, UART, USART, USB; Watchdog Timer: Yes; Number of A/D: 12; Max Supply Voltage: 5.5V; Width: 10mm; Min Operating Temperature: -40°C; Core Architecture: AVR; Contact Plating: -; RoHS: Yes; Manufacturer P/N: ATMEGA32U4-AU; Case/Package: TQFP; Max Frequency: 16MHz; Height: 1.05mm; Number of Programmable I/O: 26; Max Operating Temperature: 85°C; Mounting Technology: SMD; Pins: 44
U3 = U01-0007-01-00000-1: AVR ATmega Microcontroller 8-bit 16MHz 256KB FLASH TQFP100; Manufacturer: Microchip; Oscillator Type: External; Interface: I2C, SPI, UART; Minimum Supply Voltage: 4.5V; Peripherals: Brown-out Detect/Reset, POR, PWM, WDT; Number of A/D: 1 AD / 16 channels; Watchdog Timer: Yes; Number of I/O: 86; RAM Size: 8KB; Max Supply Voltage: 5.5V; Max Operating Temperature: 85°C; Manufacturer P/N: ATMEGA2560-16AU; Memory Size: 256KB; Mounting Technology: SMD; Memory Type: FLASH; Pins: 100; Height: 1.2mm; Case/Package: A; RoHS: Yes; Min Operating Temperature: -40°C; Max Frequency: 16MHz; Number of Programmable I/O: 86; Contact Plating: Tin; Core Architecture: AVR; Frequency: 16MHz; Width: 16.25mm
U6 = CMP-00023-00003-1: DS1682 Series 5.5 V I2C 2-Wire Serial Surface Mount Real Time Clock - SOIC-8; Manufacturer: Maxim; Min Supply Voltage: 2.5V; Max Supply Voltage: 5.5V; Height: 1.5 mm; Manufacturer P/N: DS1682S+; Interface: I2C; Length: 5 mm; Min Operating Temperature: -40°C; Max Operating Temperature: 85°C; Case/Package: SOIC-8; Mounting Technology: SMD; Pins: 8; RoHS Compliant: Yes; Width: 4 mm
U7 = CMP-001-00084-4: 4.5-V to 60-V, 31mΩ, 0.6-6A eFuse with output power limiting and surge protection 20-HTSSOP -40 to 125; Manufacturer: Texas Instruments; Number Pins: 20; Height: 1.2mm; Mounting Type: SMD; Width: 4.4mm; ROHS: Yes; Thickness: 1mm; Length: 6.5mm; Manufacturer P/N: TPS26631PWPR
Y1 Y2 = Y01-0001-01-00000-11: 16MHz ±10ppm 16pF 80Ω SMD-2520_4P; Manufacturer: SEIKO-EPSON; ESR: 80; RoHS Compliant: yes; Min Operating Temperature: -40°C; Load Capacitance: 16pF; Mounting Technology: SMD; Pins: 4; Case/Package: SMD-2520_4P; Max Operating Temperature: 85°C; Frequency: 16MHz; Manufacturer P/N: Q24FA20H0024700
Z1 Z2 = Z01-0603-01-00000-1: ESD Suppressor Multilayer Varistor 5V Automotive 2-Pin Case 0603; Manufacturer: Bourns; Capacitance: 0.5pF; Number Pins: 2; Clamping Voltage: 20V; Leakage Current: 50nA; Parameter: 1ns; Manufacturer P/N: CG0603MLC-05E; Voltage: 5V; Case/Package: 0603; Contact Plating: tin; Max Operating Temperature: 85°C; Length: 1.6mm; Depth: 800µm; RoHS: Yes; Thickness: 800µm; Width: 800µm; Min Operating Temperature: -40°C